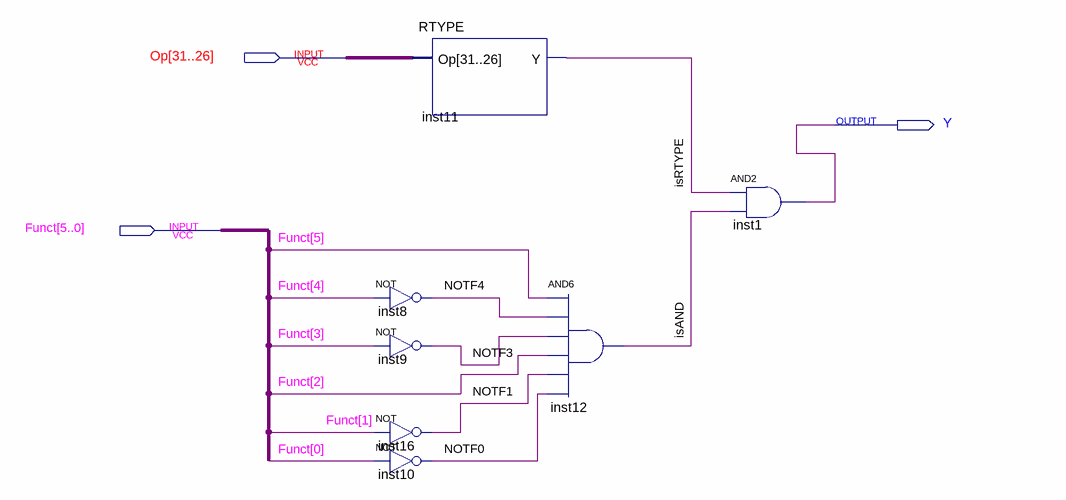
[diagram p0: schematic sheet]
// Quartus schematic ANDD.bdf as structural Verilog: 7 symbols, 3 pins
module ANDD (
  input  [31:26] Op,
  input  [5:0] Funct,
  output Y
);

  wire isAND, isRTYPE, NOTF0, NOTF1, NOTF3, NOTF4;

  not inst8 (NOTF4, Funct[4]);
  not inst9 (NOTF3, Funct[3]);
  not inst16 (NOTF1, Funct[1]);
  not inst10 (NOTF0, Funct[0]);
  RTYPE inst11 (.Op(Op), .Y(isRTYPE));
  and inst12 (isAND, Funct[5], NOTF4, NOTF3, Funct[2], NOTF1, NOTF0);
  and inst1 (Y, isRTYPE, isAND);
endmodule
